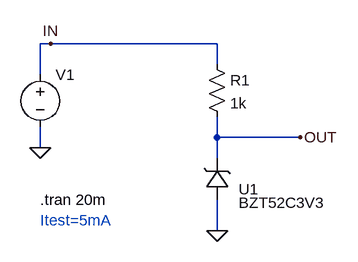
[diagram p0: schematic 2V2.asc]
2V2.asc, the LTspice schematic file:
Version 4.1
SHEET 1 880 680
WIRE 0 32 -16 32
WIRE 256 32 0 32
WIRE 256 64 256 32
WIRE -16 80 -16 32
WIRE 256 176 256 144
WIRE 384 176 256 176
WIRE -16 192 -16 160
WIRE 256 208 256 176
WIRE 256 320 256 272
FLAG -16 192 0
FLAG 256 320 0
FLAG 384 176 OUT
FLAG 0 32 IN
SYMBOL voltage -16 64 R0
WINDOW 123 0 0 Left 0
WINDOW 39 0 0 Left 0
WINDOW 3 41 64 Invisible 2
SYMATTR InstName V1
SYMATTR Value SINE({8.3/2} {8.3/2} 50)
SYMBOL res 240 48 R0
SYMATTR InstName R1
SYMATTR Value 1k
SYMBOL MyLib\\Diode_Zener\\BZT52C3V3 240 272 M180
WINDOW 38 49 -5 Left 2
SYMATTR InstName U1
TEXT -16 272 Left 2 !.tran 20m
TEXT -16 304 Left 2 ;Itest=5mA

The netlist it stands for:
* 2V2.asc
V1 IN 0 SINE({8.3/2} {8.3/2} 50)
R1 IN OUT 1k
X§U1 0 OUT BZT52C3V3  ; pins + -
.tran 20m
* Itest=5mA
.lib MyLib/Diode_Zener/BZT52C3V3.lib
.backanno
.end